# Altium schematic sheet CR00041.SchDoc: CR00041
size A4; Organization: Trenz Electronic GmbH; DocumentNumber: CR00041; Revision: 01; SheetNumber: 2; SheetTotal: 2; Date: 2019-11-14; CompanyName: Trenz Electronic GmbH
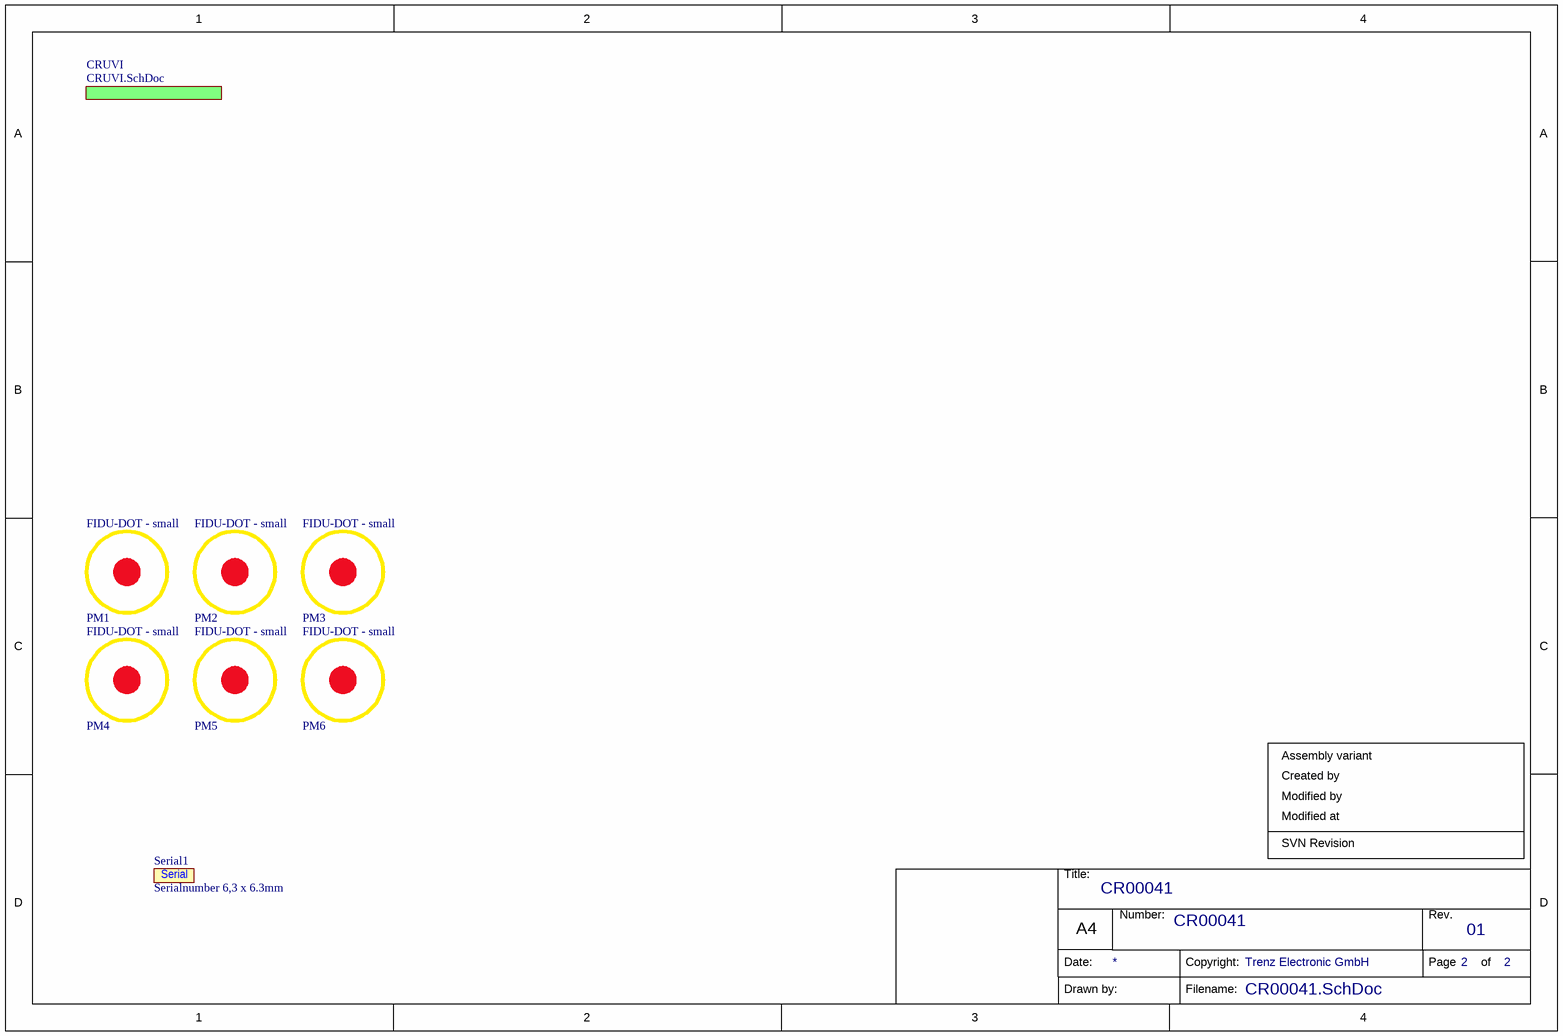
[diagram p0: CR00041.SchDoc]

## Parts
PM1  FIDU-DOT - small  [FIDU-DOT - small]
PM2  FIDU-DOT - small  [FIDU-DOT - small]
PM3  FIDU-DOT - small  [FIDU-DOT - small]
PM4  FIDU-DOT - small  [FIDU-DOT - small]
PM5  FIDU-DOT - small  [FIDU-DOT - small]
PM6  FIDU-DOT - small  [FIDU-DOT - small]
Serial1  Serialnumber 6,3 x 6.3mm  [Serial_6.3x6.3mm]  (no BOM)

## Sub-sheets
CRUVI = CRUVI.SchDoc: no entries

## Notes on the sheet
- Assembly variant
- Created by
- Modified at
- Modified by
- SVN Revision
- Title:
- Number:
- Rev.
- Date:
- A4
- Copyright:
- Page
- of
- Drawn by:
- Filename:

## Library data of the parts
PM1-PM6 = 22905: FIDU-DOT - SMALL 1mm; AN: 22905; Mixed: FIDU
Serial1 = 26753: AN: 26753; Mixed: MECH; H-ART: 39068